# Altium schematic sheet Sheet1.SchDoc
size A4; SheetNumber: 1; SheetTotal: 1
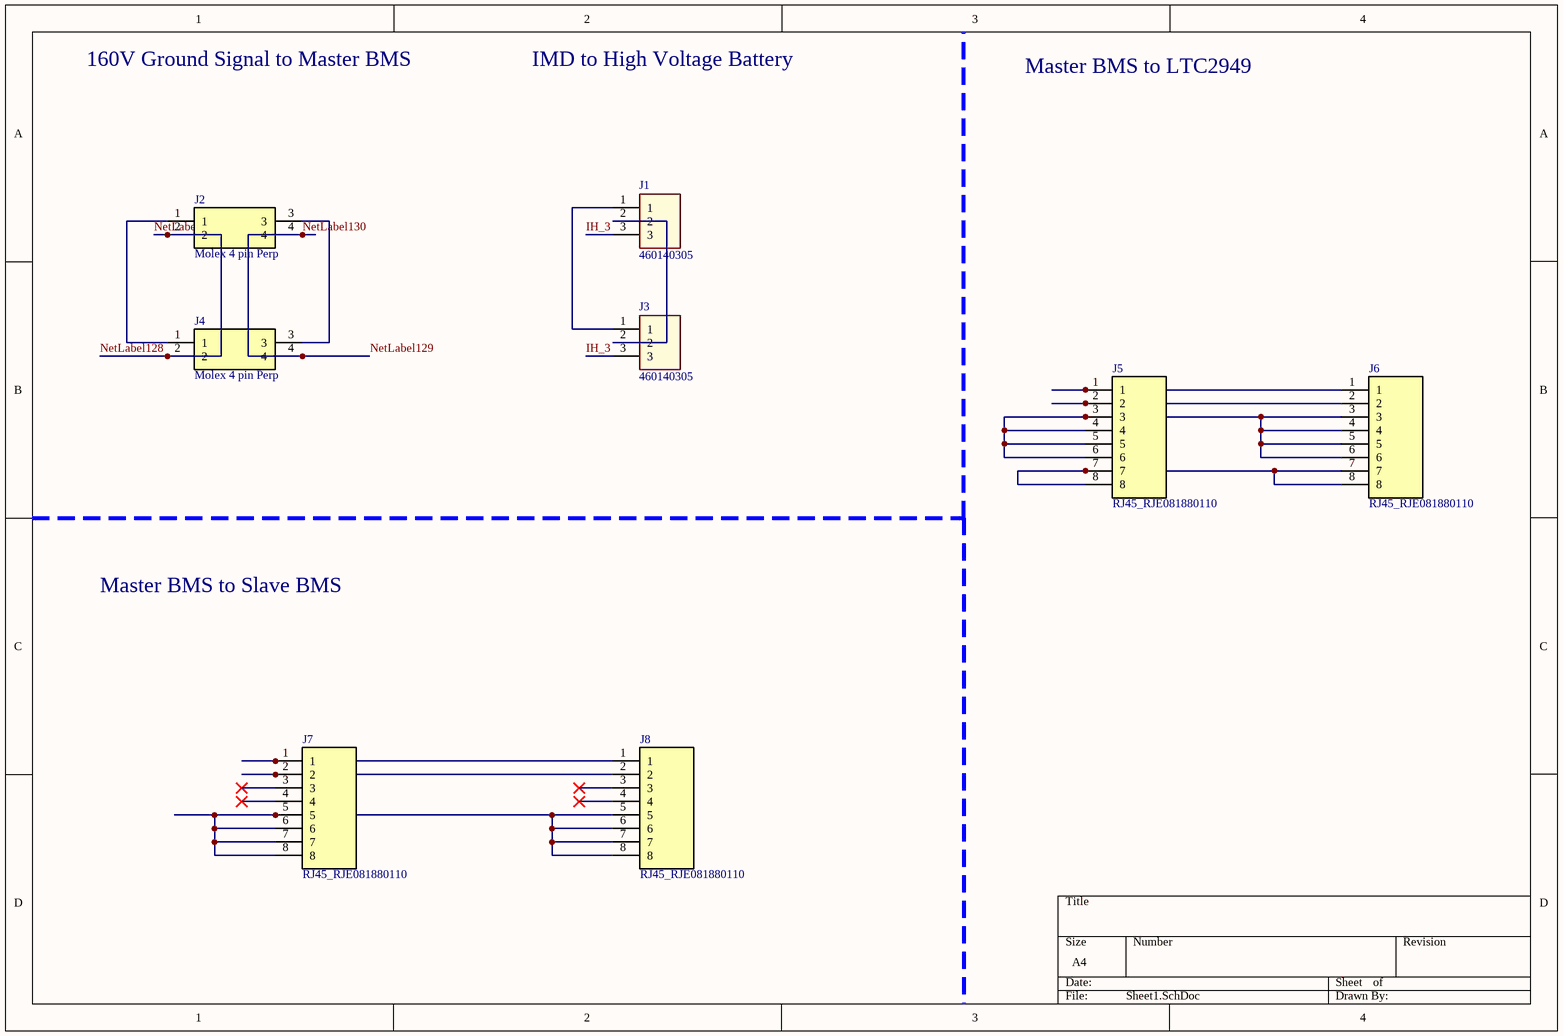
[diagram p0: Sheet1.SchDoc]

## Parts
J1  460140305  [MOLEX_460140305_3pin header]
J2  Molex 4 pin Perp  [MOLEX_462071004]
J3  460140305  [MOLEX_460140305_3pin header]
J4  Molex 4 pin Perp  [MOLEX_462071004]
J5  RJ45_RJE081880110  [RJ45_RJE081880110]
J6  RJ45_RJE081880110  [RJ45_RJE081880110]
J7  RJ45_RJE081880110  [RJ45_RJE081880110]
J8  RJ45_RJE081880110  [RJ45_RJE081880110]

## Nets
IH_3: J1.3 J3.3
NetLabel127: J2.2 J4.2  [also labelled NetLabel128]
NetLabel129: J2.4 J4.4  [also labelled NetLabel130]
NetJ1_1: J1.1 J3.1
NetJ1_2: J1.2 J3.2
NetJ2_1: J2.1 J4.1
NetJ2_3: J2.3 J4.3
NetJ5_1: J5.1 J6.1
NetJ5_2: J5.2 J6.2
NetJ5_3: J5.3 J5.4 J5.5 J5.6 J6.3 J6.4 J6.5 J6.6
NetJ5_7: J5.7 J5.8 J6.7 J6.8
NetJ7_1: J7.1 J8.1
NetJ7_2: J7.2 J8.2
NetJ7_5: J7.5 J7.6 J7.7 J7.8 J8.5 J8.6 J8.7 J8.8

Not connected (* = marked no-connect by the designer): J7 3* 4*; J8 3* 4*

## Notes on the sheet
- 160V Ground Signal to Master BMS
- IMD to High Voltage Battery
- Master BMS to LTC2949
- Master BMS to Slave BMS

## Library data of the parts
J2 J4 = Molex 4 pin Perp: Connector Header Through Hole 4 position 0.165in (4.20mm); MP: 462071004; Price: None; Availability: Unavailable; Value: *; Package: None
J5-J8 = RJ45_RJE081880110: RJ45 Modular Jack - Verticals, Input Output Connectors 8P8C, Without Shield.; MF: Amphenol ICC (Commercial Products); SnapEDA_Link: https://www.snapeda.com/parts/RJE081880110/Amphenol/view-part/?ref=snap; Value: *; Purchase-URL: https://pricing.snapeda.com/search/part/RJE081880110/?ref=eda; Check_prices: https://www.snapeda.com/parts/RJE081880110/Amphenol/view-part/?ref=eda; Availability: In Stock; Price: None; MP: RJE081880110; Package: None
J1 J3 = 460140305: Value: *; Price: None; Package: None; Availability: Unavailable; MP: 460140305